# EAGLE schematic PlantSynth v14 (EAGLE 9.7.0)
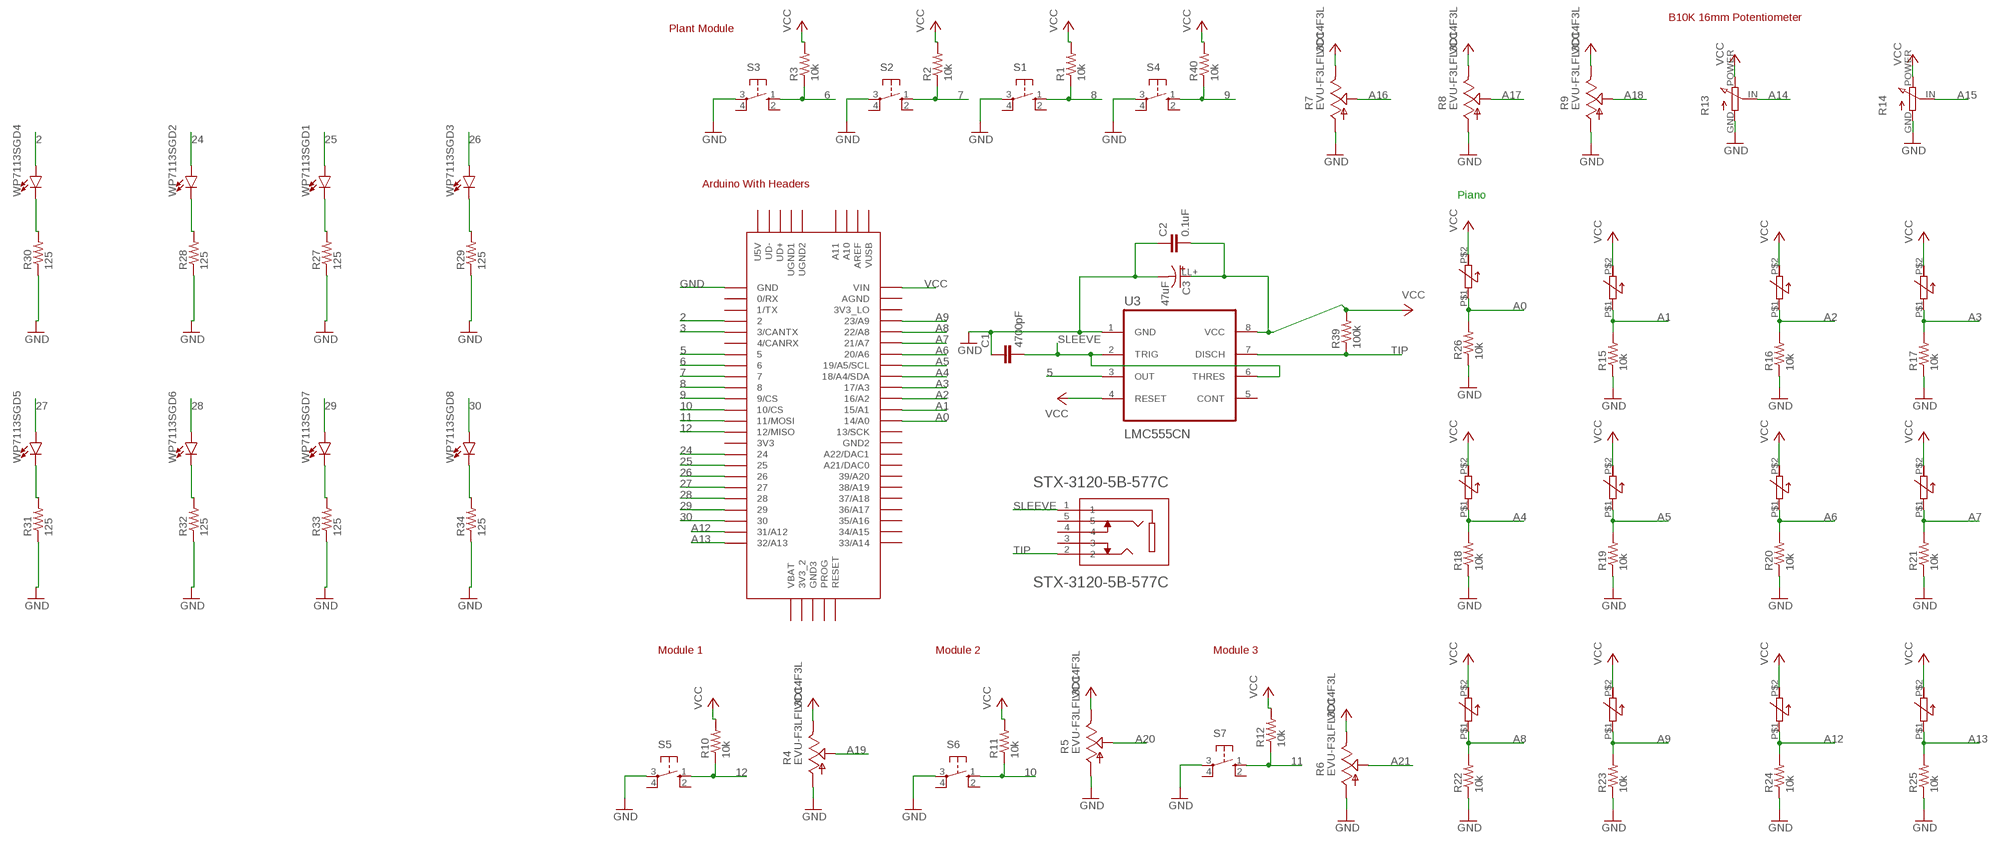
[diagram p0: schematic, sheet 1]

## Parts
C1  4700pF  C2.5/2  [C2.5-2]
C2  0.1uF  C2.5/2  [C2.5-2]
C3  47uF  ESK476M050AE3EAESK476M050AE3EA  [ESK476M050AE3EA_47UF_CAP]
FSR1  FSR400_0.85  [FSR400_.85]
FSR2  FSR400_0.85  [FSR400_.85]
FSR3  FSR400_0.85  [FSR400_.85]
FSR4  FSR400_0.85  [FSR400_.85]
FSR5  FSR400_0.85  [FSR400_.85]
FSR6  FSR400_0.85  [FSR400_.85]
FSR7  FSR400_0.85  [FSR400_.85]
FSR8  FSR400_0.85  [FSR400_.85]
FSR9  FSR400_0.85  [FSR400_.85]
FSR10  FSR400_0.85  [FSR400_.85]
FSR11  FSR400_0.85  [FSR400_.85]
FSR12  FSR400_0.85  [FSR400_.85]
R1  10k  R-US_R0603  [R0603]
R2  10k  R-US_R0603  [R0603]
R3  10k  R-US_R0603  [R0603]
R4  EVU-F3LFL3D14F3L  [EVUFXL]
R5  EVU-F3LFL3D14F3L  [EVUFXL]
R6  EVU-F3LFL3D14F3L  [EVUFXL]
R7  EVU-F3LFL3D14F3L  [EVUFXL]
R8  EVU-F3LFL3D14F3L  [EVUFXL]
R9  EVU-F3LFL3D14F3L  [EVUFXL]
R10  10k  R-US_R0603  [R0603]
R11  10k  R-US_R0603  [R0603]
R12  10k  R-US_R0603  [R0603]
R13  B3B-XH-AB3B  [B3B-XH-A]
R14  B3B-XH-AB3B  [B3B-XH-A]
R15  10k  R-US_R0603  [R0603]
R16  10k  R-US_R0603  [R0603]
R17  10k  R-US_R0603  [R0603]
R18  10k  R-US_R0603  [R0603]
R19  10k  R-US_R0603  [R0603]
R20  10k  R-US_R0603  [R0603]
R21  10k  R-US_R0603  [R0603]
R22  10k  R-US_R0603  [R0603]
R23  10k  R-US_R0603  [R0603]
R24  10k  R-US_R0603  [R0603]
R25  10k  R-US_R0603  [R0603]
R26  10k  R-US_R0603  [R0603]
R27  125  R-US_R0603  [R0603]
R28  125  R-US_R0603  [R0603]
R29  125  R-US_R0603  [R0603]
R30  125  R-US_R0603  [R0603]
R31  125  R-US_R0603  [R0603]
R32  125  R-US_R0603  [R0603]
R33  125  R-US_R0603  [R0603]
R34  125  R-US_R0603  [R0603]
R39  100k  R-US_R0603  [R0603]
R40  10k  R-US_R0603  [R0603]
S1  B3F-1020  [B3F-10XX]
S2  B3F-1020  [B3F-10XX]
S3  B3F-1020  [B3F-10XX]
S4  B3F-1020  [B3F-10XX]
S5  B3F-1020  [B3F-10XX]
S6  B3F-1020  [B3F-10XX]
S7  B3F-1020  [B3F-10XX]
STX-3120-5B-577C  STX-3120-5B-577C  [STX-3120-5B-577C]
U3  LMC555CN  [LMC555CN/NOPB-ND]
U$1  TEENSY_3.5/3.6  [TEENSY_3.5/3.6]
WP7113SGD1  LEDGREEN_KINGBRIGHT_WP7113SGDWP7113SGD  [LEDGREENDIFFUSED5MM]
WP7113SGD2  LEDGREEN_KINGBRIGHT_WP7113SGDWP7113SGD  [LEDGREENDIFFUSED5MM]
WP7113SGD3  LEDGREEN_KINGBRIGHT_WP7113SGDWP7113SGD  [LEDGREENDIFFUSED5MM]
WP7113SGD4  LEDGREEN_KINGBRIGHT_WP7113SGDWP7113SGD  [LEDGREENDIFFUSED5MM]
WP7113SGD5  LEDGREEN_KINGBRIGHT_WP7113SGDWP7113SGD  [LEDGREENDIFFUSED5MM]
WP7113SGD6  LEDGREEN_KINGBRIGHT_WP7113SGDWP7113SGD  [LEDGREENDIFFUSED5MM]
WP7113SGD7  LEDGREEN_KINGBRIGHT_WP7113SGDWP7113SGD  [LEDGREENDIFFUSED5MM]
WP7113SGD8  LEDGREEN_KINGBRIGHT_WP7113SGDWP7113SGD  [LEDGREENDIFFUSED5MM]

## Nets
2: U$1.2 WP7113SGD4.A+(ANODE(+))
3: U$1.3/CANTX
5: U3.3(OUT) U$1.5
6: R3.1 S3.1(S) U$1.6
7: R2.1 S2.1(S) U$1.7
8: R1.1 S1.1(S) U$1.8
9: R40.1 S4.1(S) U$1.9/CS
10: R11.1 S6.1(S) U$1.10/CS
11: R12.1 S7.1(S) U$1.11/MOSI
12: R10.1 S5.1(S) U$1.12/MISO
24: U$1.24 WP7113SGD2.A+(ANODE(+))
25: U$1.25 WP7113SGD1.A+(ANODE(+))
26: U$1.26 WP7113SGD3.A+(ANODE(+))
27: U$1.27 WP7113SGD5.A+(ANODE(+))
28: U$1.28 WP7113SGD6.A+(ANODE(+))
29: U$1.29 WP7113SGD7.A+(ANODE(+))
30: U$1.30 WP7113SGD8.A+(ANODE(+))
A0: FSR12.P$1(OUT/GND) R26.2 U$1.14/A0
A1: FSR1.P$1(OUT/GND) R15.2 U$1.15/A1
A2: FSR2.P$1(OUT/GND) R16.2 U$1.16/A2
A3: FSR3.P$1(OUT/GND) R17.2 U$1.17/A3
A4: FSR4.P$1(OUT/GND) R18.2 U$1.18/A4/SDA
A5: FSR5.P$1(OUT/GND) R19.2 U$1.19/A5/SCL
A6: FSR6.P$1(OUT/GND) R20.2 U$1.20/A6
A7: FSR7.P$1(OUT/GND) R21.2 U$1.21/A7
A8: FSR8.P$1(OUT/GND) R22.2 U$1.22/A8
A9: FSR9.P$1(OUT/GND) R23.2 U$1.23/A9
A12: FSR10.P$1(OUT/GND) R24.2 U$1.31/A12
A13: FSR11.P$1(OUT/GND) R25.2 U$1.32/A13
A14: R13.IN
A15: R14.IN
A16: R7.IN
A17: R8.IN
A18: R9.IN
A19: R4.IN
A20: R5.IN
A21: R6.IN
GND: C1.1 C2.1 C3.LL-(-) R4.GND R5.GND R6.GND R7.GND R8.GND R9.GND R13.GND R14.GND R15.1 R16.1 R17.1 R18.1 R19.1 R20.1 R21.1 R22.1 R23.1 R24.1 R25.1 R26.1 R27.1 R28.1 R29.1 R30.1 R31.1 R32.1 R33.1 R34.1 S1.3(P) S2.3(P) S3.3(P) S4.3(P) S5.3(P) S6.3(P) S7.3(P) U3.1(GND) U$1.GND
N$1: R28.2 WP7113SGD2.C-(CATHODE(-))
N$2: R27.2 WP7113SGD1.C-(CATHODE(-))
N$3: R29.2 WP7113SGD3.C-(CATHODE(-))
N$4: R30.2 WP7113SGD4.C-(CATHODE(-))
N$5: R31.2 WP7113SGD5.C-(CATHODE(-))
N$6: R32.2 WP7113SGD6.C-(CATHODE(-))
N$7: R33.2 WP7113SGD7.C-(CATHODE(-))
N$8: R34.2 WP7113SGD8.C-(CATHODE(-))
SLEEVE: C1.2 STX-3120-5B-577C.1 U3.2(TRIG) U3.6(THRES)
TIP: R39.1 STX-3120-5B-577C.2 U3.7(DISCH)
VCC: C2.2 C3.LL+(+) FSR1.P$2(VCC) FSR2.P$2(VCC) FSR3.P$2(VCC) FSR4.P$2(VCC) FSR5.P$2(VCC) FSR6.P$2(VCC) FSR7.P$2(VCC) FSR8.P$2(VCC) FSR9.P$2(VCC) FSR10.P$2(VCC) FSR11.P$2(VCC) FSR12.P$2(VCC) R1.2 R2.2 R3.2 R4.PWR(POWER) R5.PWR(POWER) R6.PWR(POWER) R7.PWR(POWER) R8.PWR(POWER) R9.PWR(POWER) R10.2 R11.2 R12.2 R13.POWER R14.POWER R39.2 R40.2 U3.4(RESET) U3.8(VCC) U$1.VIN
Unconnected: S1.2(S1) S1.4(P1) S2.2(S1) S2.4(P1) S3.2(S1) S3.4(P1) S4.2(S1) S4.4(P1) S5.2(S1) S5.4(P1) S6.2(S1) S6.4(P1) S7.2(S1) S7.4(P1) STX-3120-5B-577C.3 STX-3120-5B-577C.4 STX-3120-5B-577C.5 U3.5(CONT) U$1.0/RX U$1.1/TX U$1.3V3 U$1.3V3_2 U$1.3V3_LO U$1.4/CANRX U$1.13/SCK U$1.21/DAC0(A21/DAC0) U$1.33/A14 U$1.34/A15 U$1.35/A16 U$1.36/A17 U$1.37/A18 U$1.38/A19 U$1.39/A20 U$1.A10 U$1.A11 U$1.A22/DAC1 U$1.AGND U$1.AREF U$1.GND2 U$1.GND3 U$1.PROG U$1.RESET U$1.U5V U$1.UD+ U$1.UD- U$1.UGND1 U$1.UGND2 U$1.VBAT U$1.VUSB

## Notes on the sheet
- B10K 16mm Potentiometer
- Plant Module
- Arduino With Headers
- Piano
- Module 1 | Module 2 | Module 3

## Library data of the parts
C1 C2 = capacitor-wima:C: CAPACITOR naming: grid - package width
C3 = Capacitor_47uF:ESK476M050AE3EA: Capacitor Polarised - ANSI
FSR1-FSR12 = FSR400:FSR400_0.85: FSR400
R1-R3 R10-R12 R15-R34 R39 R40 = rcl:R-US_: RESISTOR, American symbol; SPICEPREFIX: R
R4-R9 = EVU-F3LFL3D14_US:EVU-F3LFL3D14: 9 mm Square Rotary Potentiometers Source: Panasonic EVU-F3LFL3D14 https://www.digikey.com/en/products/detail/panasonic-electronic-components/EVU-F3LFL3D14/243633
R13 R14 = Pot_16mm:B3B-XH-A: 16mm pot from DHV B10K with B3B-XH-A 3 pin header
S1-S7 = B3F-1020_OMRON:B3F-1020: OMRON SWITCH; MPN: B3F-1000; OC_FARNELL: 176432; OC_NEWARK: 36M3542
STX-3120-5B-577C = STX-3120-5B-577C:STX-3120-5B-577C: STEREO JACK, ALL PLASTIC, LT GRE
U3 = LMC555CN:NOPB-ND:LMC555CN: LMC555CN/NOPB-ND PDIP(8) TI 9.81x6.35mm
U$1 = Teensy356:TEENSY_3.5/3.6
WP7113SGD1-WP7113SGD8 = KingBright_LED_WP7113SGD:LEDGREEN_KINGBRIGHT_WP7113SGD: WP7113SGD Kingbright super bright green 5mm diameter 2.54 mm between pegs 8.6mm in height Bottom is 5.9mm in diameter Forward Voltage at 20mA is 2.2-2.5 V 5V

## Module FSR_400_30-49649
Ports: 

### Library data of the parts